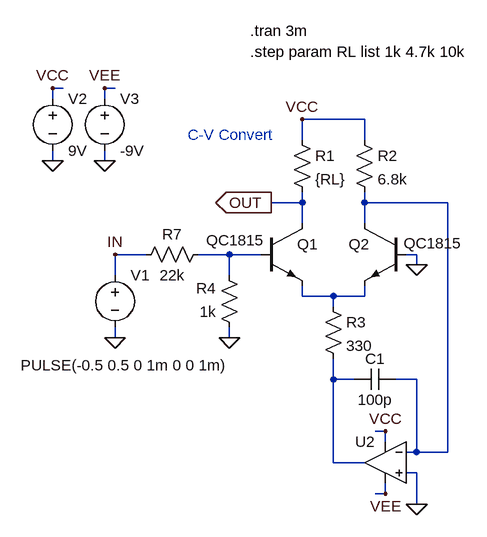
[diagram p0: schematic LadderFilter_CurrentSource_og3_2SC1815.asc]
LadderFilter_CurrentSource_og3_2SC1815.asc, the LTspice schematic file:
Version 4
SHEET 1 1028 748
WIRE 208 48 192 48
WIRE 288 48 272 48
WIRE 192 64 192 48
WIRE 272 64 272 48
WIRE 672 96 576 96
WIRE 576 128 576 96
WIRE 672 128 672 96
WIRE 192 160 192 144
WIRE 272 160 272 144
WIRE 576 224 576 208
WIRE 576 224 528 224
WIRE 672 224 672 208
WIRE 800 224 672 224
WIRE 576 256 576 224
WIRE 672 256 672 224
WIRE 336 304 288 304
WIRE 464 304 416 304
WIRE 512 304 464 304
WIRE 752 304 736 304
WIRE 752 320 752 304
WIRE 288 336 288 304
WIRE 464 336 464 304
WIRE 576 368 576 352
WIRE 624 368 576 368
WIRE 672 368 672 352
WIRE 672 368 624 368
WIRE 624 384 624 368
WIRE 288 432 288 416
WIRE 464 432 464 416
WIRE 624 496 624 464
WIRE 656 496 624 496
WIRE 752 496 720 496
WIRE 704 576 688 576
WIRE 704 592 704 576
WIRE 752 608 752 496
WIRE 752 608 736 608
WIRE 800 608 800 224
WIRE 800 608 752 608
WIRE 624 624 624 496
WIRE 672 624 624 624
WIRE 752 640 736 640
WIRE 704 672 704 656
WIRE 704 672 688 672
WIRE 752 688 752 640
FLAG 752 320 0
FLAG 576 96 VCC
FLAG 288 432 0
FLAG 192 160 0
FLAG 272 160 0
FLAG 192 48 VCC
FLAG 272 48 VEE
FLAG 288 304 IN
FLAG 464 432 0
FLAG 752 688 0
FLAG 704 576 VCC
FLAG 704 672 VEE
FLAG 528 224 OUT
IOPIN 528 224 Out
SYMBOL npn 512 256 R0
WINDOW 3 -84 26 Left 2
SYMATTR Value QC1815
SYMATTR InstName Q1
SYMBOL npn 736 256 M0
WINDOW 3 -86 31 Left 2
SYMATTR Value QC1815
SYMATTR InstName Q2
SYMBOL res 560 112 R0
SYMATTR InstName R1
SYMATTR Value {RL}
SYMBOL res 656 112 R0
SYMATTR InstName R2
SYMATTR Value 6.8k
SYMBOL res 608 368 R0
SYMATTR InstName R3
SYMATTR Value 330
SYMBOL res 480 432 R180
WINDOW 0 36 76 Left 2
WINDOW 3 36 40 Left 2
SYMATTR InstName R4
SYMATTR Value 1k
SYMBOL voltage 288 320 R0
WINDOW 3 -145 154 Left 2
WINDOW 123 0 0 Left 2
WINDOW 39 0 0 Left 2
SYMATTR Value PULSE(-0.5 0.5 0 1m 0 0 1m)
SYMATTR InstName V1
SYMBOL voltage 192 48 R0
WINDOW 123 0 0 Left 2
WINDOW 39 0 0 Left 2
SYMATTR InstName V2
SYMATTR Value 9V
SYMBOL voltage 272 48 R0
WINDOW 123 0 0 Left 2
WINDOW 39 0 0 Left 2
SYMATTR InstName V3
SYMATTR Value -9V
SYMBOL res 320 320 R270
WINDOW 0 32 56 VTop 2
WINDOW 3 0 56 VBottom 2
SYMATTR InstName R7
SYMATTR Value 22k
SYMBOL Opamps\\UniversalOpamp2 704 624 M0
SYMATTR InstName U2
SYMBOL cap 656 480 M90
WINDOW 0 0 32 VBottom 2
WINDOW 3 32 32 VTop 2
SYMATTR InstName C1
SYMATTR Value 100p
TEXT 496 -40 Left 2 !.tran 3m
TEXT 496 -8 Left 2 !.step param RL list 1k 4.7k 10k
TEXT 400 120 Left 2 ;C-V Convert

The netlist it stands for:
* LadderFilter_CurrentSource_og3_2SC1815.asc
Q1 OUT N002 N003 0 QC1815
Q2 N001 0 N003 0 QC1815
R1 VCC OUT {RL}
R2 VCC N001 6.8k
R3 N003 N004 330
R4 0 N002 1k
V1 IN 0 PULSE(-0.5 0.5 0 1m 0 0 1m)
V2 VCC 0 9V
V3 VEE 0 -9V
R7 IN N002 22k
XU2 0 N001 VCC VEE N004 level.2 Avol=1Meg GBW=10Meg Slew=10Meg ilimit=25m rail=0 Vos=0 phimargin=45 en=0 enk=0 in=0 ink=0 Rin=500Meg  ; pins IN+ IN- V+ V- OUT
C1 N004 N001 100p
.model NPN NPN
.model PNP PNP
.lib standard.bjt
.tran 3m
.step param RL list 1k 4.7k 10k
* C-V Convert
.lib UniversalOpamps2.sub
.backanno
.end